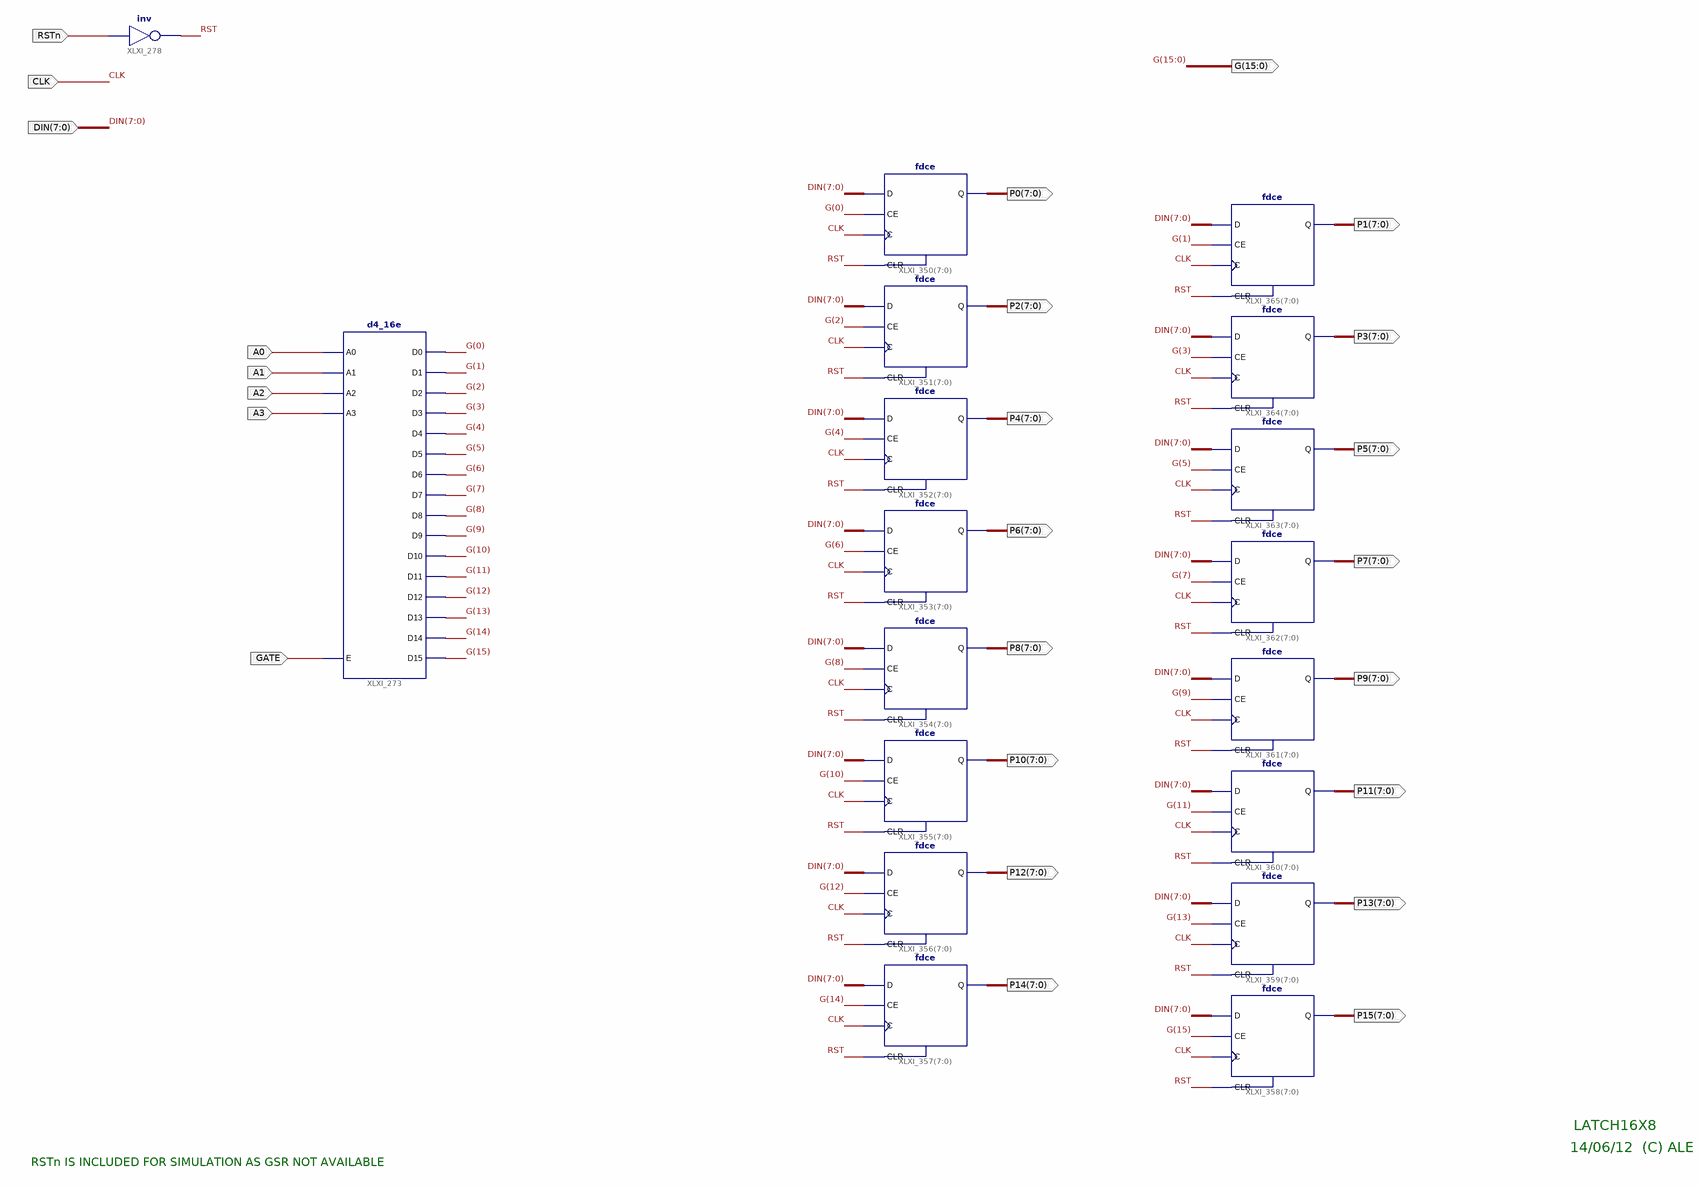
[diagram p0: schematic sheet 1]
// Xilinx ISE schematic Latch16x8.sch (spartan3e) as structural Verilog: 18 symbols, 25 ports
module Latch16x8 (
  input  RSTn,
  input  [7:0] DIN,
  input  A0,
  input  A1,
  input  A2,
  input  A3,
  input  GATE,
  input  CLK,
  output [7:0] P0,
  output [7:0] P1,
  output [7:0] P2,
  output [7:0] P3,
  output [7:0] P4,
  output [7:0] P5,
  output [7:0] P6,
  output [7:0] P7,
  output [15:0] G,
  output [7:0] P9,
  output [7:0] P11,
  output [7:0] P13,
  output [7:0] P15,
  output [7:0] P8,
  output [7:0] P10,
  output [7:0] P12,
  output [7:0] P14
);

  wire RST;

  not XLXI_278 (RST, RSTn);
  d4_16e XLXI_273 (
    .A0(A0), .A1(A1), .A2(A2), .A3(A3), .E(GATE), .D0(G[0]), .D1(G[1]), .D10(G[10]), .D11(G[11]),
    .D12(G[12]), .D13(G[13]), .D14(G[14]), .D15(G[15]), .D2(G[2]), .D3(G[3]), .D4(G[4]), .D5(G[5]),
    .D6(G[6]), .D7(G[7]), .D8(G[8]), .D9(G[9]));
  fdce XLXI_350[7:0] (.C(CLK), .CE(G[0]), .CLR(RST), .D(DIN), .Q(P0));
  fdce XLXI_351[7:0] (.C(CLK), .CE(G[2]), .CLR(RST), .D(DIN), .Q(P2));
  fdce XLXI_352[7:0] (.C(CLK), .CE(G[4]), .CLR(RST), .D(DIN), .Q(P4));
  fdce XLXI_353[7:0] (.C(CLK), .CE(G[6]), .CLR(RST), .D(DIN), .Q(P6));
  fdce XLXI_354[7:0] (.C(CLK), .CE(G[8]), .CLR(RST), .D(DIN), .Q(P8));
  fdce XLXI_355[7:0] (.C(CLK), .CE(G[10]), .CLR(RST), .D(DIN), .Q(P10));
  fdce XLXI_356[7:0] (.C(CLK), .CE(G[12]), .CLR(RST), .D(DIN), .Q(P12));
  fdce XLXI_357[7:0] (.C(CLK), .CE(G[14]), .CLR(RST), .D(DIN), .Q(P14));
  fdce XLXI_358[7:0] (.C(CLK), .CE(G[15]), .CLR(RST), .D(DIN), .Q(P15));
  fdce XLXI_359[7:0] (.C(CLK), .CE(G[13]), .CLR(RST), .D(DIN), .Q(P13));
  fdce XLXI_360[7:0] (.C(CLK), .CE(G[11]), .CLR(RST), .D(DIN), .Q(P11));
  fdce XLXI_361[7:0] (.C(CLK), .CE(G[9]), .CLR(RST), .D(DIN), .Q(P9));
  fdce XLXI_362[7:0] (.C(CLK), .CE(G[7]), .CLR(RST), .D(DIN), .Q(P7));
  fdce XLXI_363[7:0] (.C(CLK), .CE(G[5]), .CLR(RST), .D(DIN), .Q(P5));
  fdce XLXI_364[7:0] (.C(CLK), .CE(G[3]), .CLR(RST), .D(DIN), .Q(P3));
  fdce XLXI_365[7:0] (.C(CLK), .CE(G[1]), .CLR(RST), .D(DIN), .Q(P1));

  // Notes on the sheet:
  //   LATCH16X8
  //   14/06/12  (C) ALE
  //   RSTn IS INCLUDED FOR SIMULATION AS GSR NOT AVAILABLE
endmodule
